# Altium project p5n5.PrjPcb
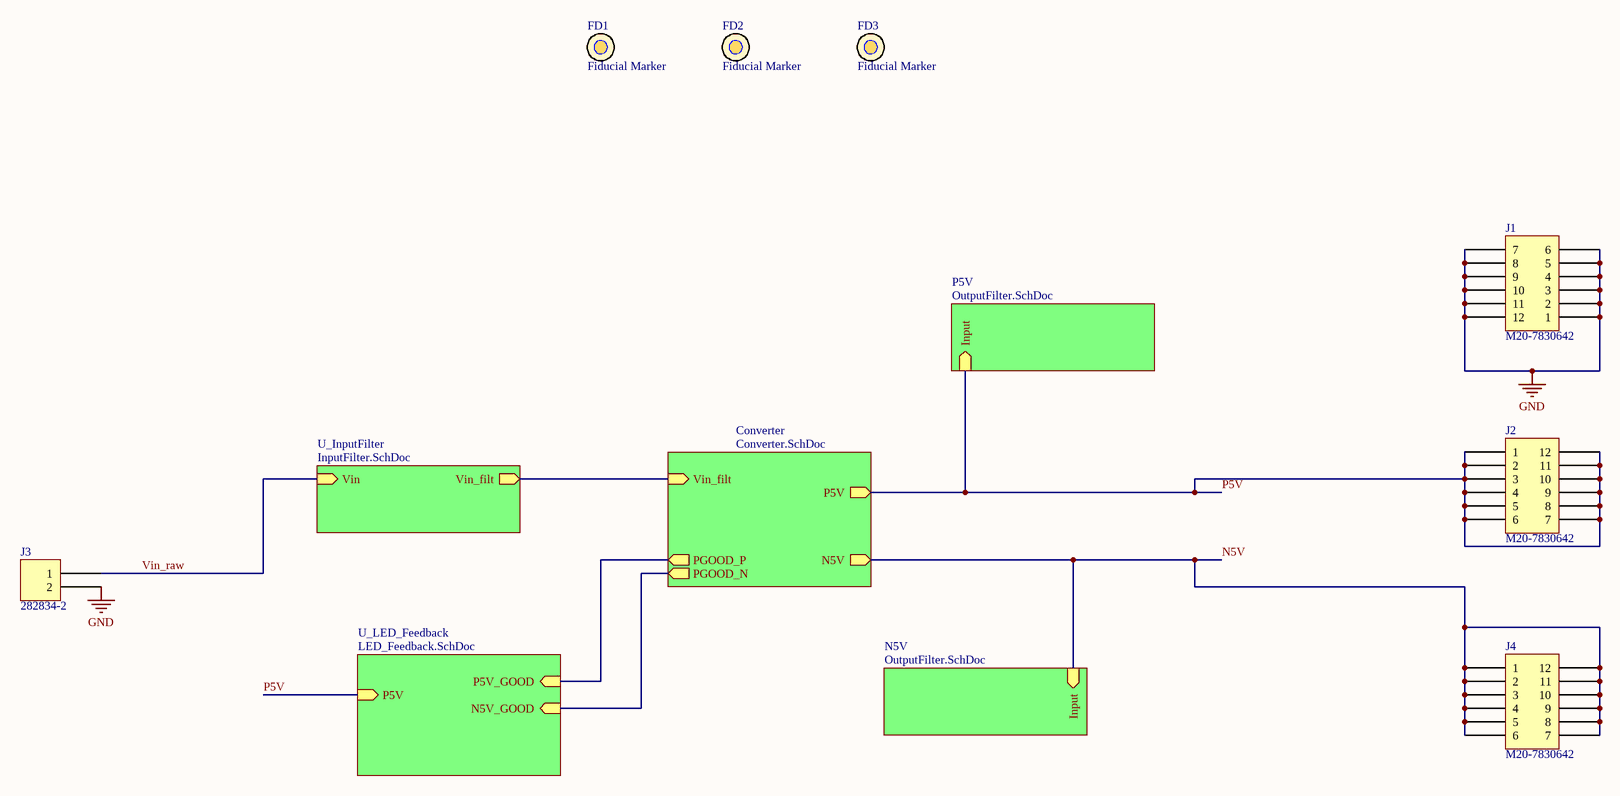
[diagram p0: TopLevel.SchDoc]
5 sheets, 50 parts. Net scope: hierarchical (ports join the sheet entries above them; power ports are global).
Board file: Board_Single.PcbDoc
Sheets:
  TopLevel.SchDoc
    Converter = Converter.SchDoc
    U_InputFilter = InputFilter.SchDoc
    P5V = OutputFilter.SchDoc
    N5V = OutputFilter.SchDoc
    U_LED_Feedback = LED_Feedback.SchDoc

## Sheet TopLevel.SchDoc
size B; SheetNumber: 1; SheetTotal: 5

### Parts
FD1  Fiducial Marker  [FIDUCIAL]
FD2  Fiducial Marker  [FIDUCIAL]
FD3  Fiducial Marker  [FIDUCIAL]
J1  M20-7830642  [HARWIN M20-7830645]
J2  M20-7830642  [HARWIN M20-7830645]
J3  282834-2  [TE 282834-2]
J4  M20-7830642  [HARWIN M20-7830645]

### Sub-sheets
Converter = Converter.SchDoc: PGOOD_P (out), N5V (out), Vin_filt (in), P5V (out), PGOOD_N (out)
N5V = OutputFilter.SchDoc: Input (in)
P5V = OutputFilter.SchDoc: Input (in)
U_InputFilter = InputFilter.SchDoc: Vin (in), Vin_filt (out)
U_LED_Feedback = LED_Feedback.SchDoc: P5V (in), P5V_GOOD (in), N5V_GOOD (in)

### Nets
GND: J1.1 J1.2 J1.3 J1.4 J1.5 J1.6 J1.7 J1.8 J1.9 J1.10 J1.11 J1.12 J3.2
N5V: J4.1 J4.2 J4.3 J4.4 J4.5 J4.6 J4.7 J4.8 J4.9 J4.10 J4.11 J4.12 ; sheet Converter/N5V, sheet N5V/Input
P5V: J2.1 J2.2 J2.3 J2.4 J2.5 J2.6 J2.7 J2.8 J2.9 J2.10 J2.11 J2.12 ; sheet Converter/P5V, sheet P5V/Input, sheet U_LED_Feedback/P5V
PGOOD_N: sheet Converter/PGOOD_N, sheet U_LED_Feedback/N5V_GOOD
PGOOD_P: sheet Converter/PGOOD_P, sheet U_LED_Feedback/P5V_GOOD
Vin_filt: sheet Converter/Vin_filt, sheet U_InputFilter/Vin_filt
Vin_raw: J3.1 ; sheet U_InputFilter/Vin

### Library data of the parts
FD1-FD3 = Fiducial
J1 J2 J4 = M20-7830642: CONN RCPT 12POS 0.1 GOLD PCB; Manufacturer: Harwin Inc.; Connector Type: Receptacle; Contact Length - Post: 0.118" (3.00mm); Current Rating (Amps): 3A; Mated Stacking Heights: 11.04mm, 12.63mm; Material Flammability Rating: UL94 V-0; Number of Positions: 12; Number of Positions Loaded: All; Pitch - Mating: 0.100" (2.54mm); Style: Board to Board or Cable; Part Number: M20-7830642; ComponentLink1Description: Datasheet; ComponentLink1URL: https://cdn.harwin.com/pdfs/C001XX_M20_Series_Connectors.pdf; ComponentLink2Description: DigiKey Link; ComponentLink2URL: https://www.digikey.com/en/products/detail/harwin-inc/M20-7830642/3727774; Contact Finish - Mating: Gold; Contact Finish - Post: Tin; Contact Finish Thickness - Mating: Flash; Contact Type: Female Socket; Fastening Type: Push-Pull; Insulation Color: Black; Insulation Height: 0.335" (8.51mm); LastUpdated: 9/21/2022 7:05:46 PM; Lifecycle Status: Active; Minimum Order: 1; Mounting Type: Through Hole; Number of Rows: 2; Operating Temperature: -40°C ~ 105°C; Packaging: Tube; Part Status: Active; Price: 0.96; Row Spacing - Mating: 0.100" (2.54mm); Series: M20; Supplier 1: DigiKey; Supplier Part Number 1: 952-1805-ND; Termination: Solder
J3 = 282834-2: TERM BLK 2P SIDE ENT 2.54MM PCB; Manufacturer: TE Connectivity AMP Connectors; Current: 10A; Mating Orientation: Horizontal with Board; Number of Levels: 1; Pitch: 0.100" (2.54mm); Positions Per Level: 2; Voltage: 150V; Wire Gauge: 16-30 AWG; Wire Termination: Screw - Rising Cage Clamp; Part Number: 282834-2; Color: Green; ComponentLink1Description: Datasheet; ComponentLink1URL: https://www.te.com/commerce/DocumentDelivery/DDEController?Action=srchrtrv&DocNm=282834&DocType=Customer+Drawing&DocLang=English; ComponentLink2Description: DigiKey Link; ComponentLink2URL: http://digikey.com/product-detail/en/te-connectivity-amp-connectors/282834-2/A98333-ND/1150135; LastUpdated: 1/15/2020 4:15:38 AM; Lifecycle Status: Active; Minimum Order: 1; Mounting Type: Through Hole; Packaging: Bulk; Part Status: Active; Price: 0.88; Series: Buchanan; Supplier 1: DigiKey; Supplier Part Number 1: A98333-ND

## Sheet Converter.SchDoc
size A; SheetNumber: 2; SheetTotal: 5
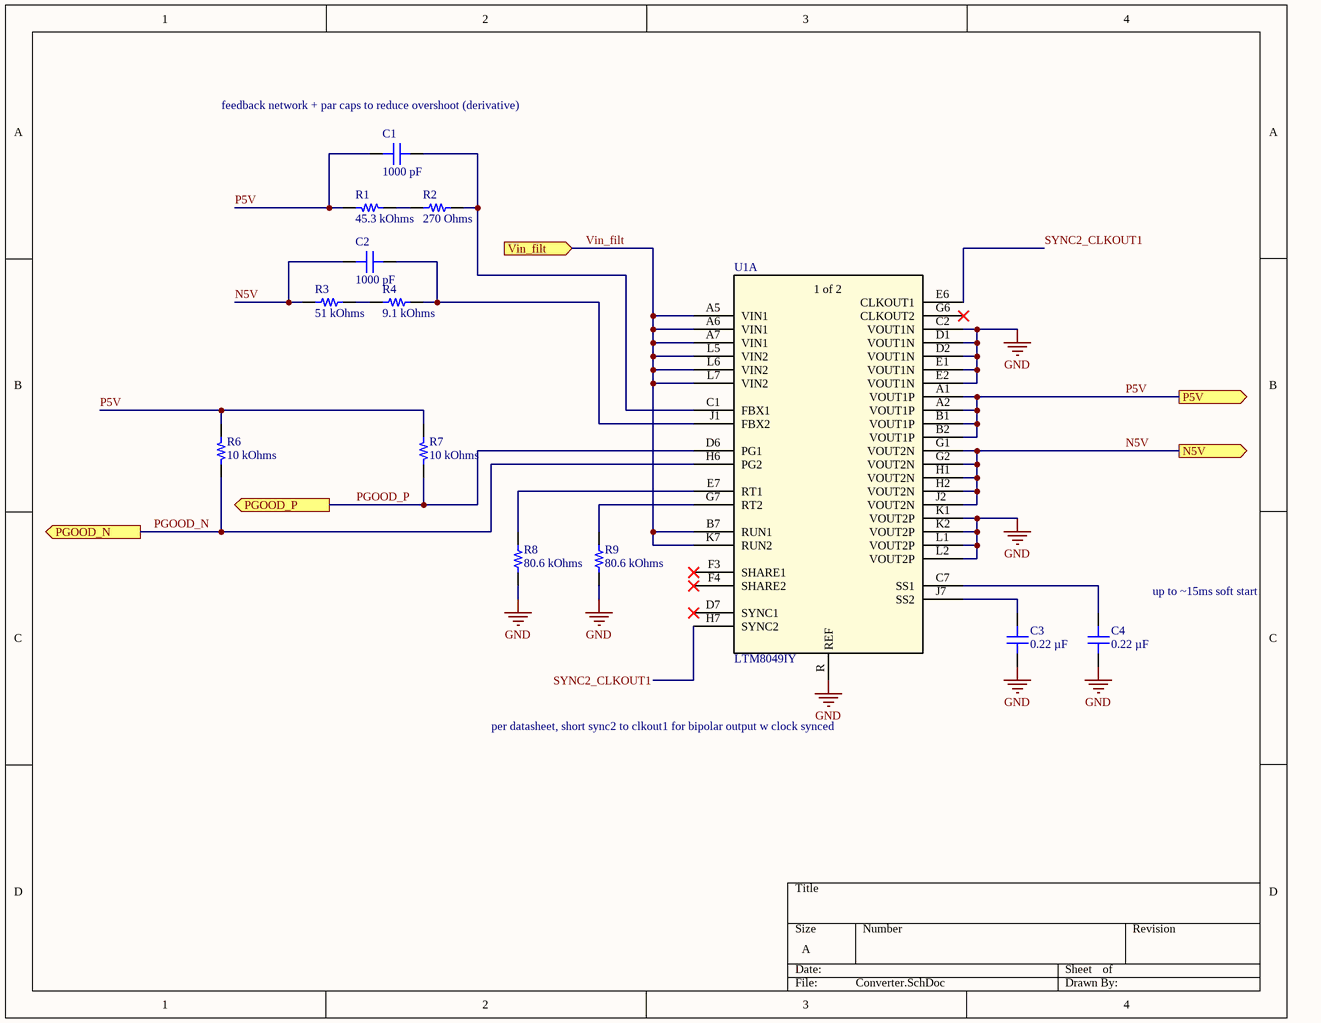
[diagram p1: Converter.SchDoc]

### Parts
C1  1000 pF  [CAP 0805_2012]
C2  1000 pF  [CAP 0805_2012]
C3  0.22 µF  [CAP 0805_2012]
C4  0.22 µF  [CAP 0805_2012]
R1  45.3 kOhms  [RES 1206_3216]
R2  270 Ohms  [RES 0805_2012]
R3  51 kOhms  [RES 0805_2012]
R4  9.1 kOhms  [RES 0805_2012]
R6  10 kOhms  [RES 0805_2012]
R7  10 kOhms  [RES 0805_2012]
R8  80.6 kOhms  [RES 1206_3216]
R9  80.6 kOhms  [RES 1206_3216]
U1  LTM8049IY  [LTM8049IY_ADI]  (part A of 2)

### Ports
N5V (out), P5V (out), PGOOD_N (out), PGOOD_P (out), Vin_filt (in)

### Nets
GND: C3.1 C4.1 R8.1 R9.1 U1.C2(VOUT1N) U1.D1(VOUT1N) U1.D2(VOUT1N) U1.E1(VOUT1N) U1.E2(VOUT1N) U1.K1(VOUT2P) U1.K2(VOUT2P) U1.L1(VOUT2P) U1.L2(VOUT2P) U1.R(REF)
N5V: C2.1 R3.1 U1.G1(VOUT2N) U1.G2(VOUT2N) U1.H1(VOUT2N) U1.H2(VOUT2N) U1.J2(VOUT2N) ; port N5V
P5V: C1.1 R1.1 R6.2 R7.2 U1.A1(VOUT1P) U1.A2(VOUT1P) U1.B1(VOUT1P) U1.B2(VOUT1P) ; port P5V
PGOOD_N: R6.1 U1.H6(PG2) ; port PGOOD_N
PGOOD_P: R7.1 U1.D6(PG1) ; port PGOOD_P
SYNC2_CLKOUT1: U1.E6(CLKOUT1) U1.H7(SYNC2)
Vin_filt: U1.A5(VIN1) U1.A6(VIN1) U1.A7(VIN1) U1.B7(RUN1) U1.K7(RUN2) U1.L5(VIN2) U1.L6(VIN2) U1.L7(VIN2) ; port Vin_filt
NetC1_2: C1.2 R2.2 U1.C1(FBX1)
NetC2_2: C2.2 R4.2 U1.J1(FBX2)
NetC3_2: C3.2 U1.J7(SS2)
NetC4_2: C4.2 U1.C7(SS1)
NetR1_2: R1.2 R2.1
NetR3_2: R3.2 R4.1
NetR8_2: R8.2 U1.E7(RT1)
NetR9_2: R9.2 U1.G7(RT2)

Not connected (* = marked no-connect by the designer): U1 D7(SYNC1)* F3(SHARE1)* F4(SHARE2)* G6(CLKOUT2)*

### Notes on the sheet
- (near C1) feedback network + par caps to reduce overshoot (derivative)
- up to ~15ms soft start
- per datasheet, short sync2 to clkout1 for bipolar output w clock synced
- (in symbol LTM8049IY, part A) 1 of 2

### Library data of the parts
C1 C2 = C0805C102J5RAC7800: CAP CER 1000PF 50V X7R 0805; Part Number: C0805C102J5RACTU; manufacturer: KEMET; Tolerance: ±5%; Value: 1000 pF; Applications: Bypass, Decoupling; Capacitance: 1000 pF; componentlink1description: Datasheet; componentlink1url: https://api.kemet.com/component-edge/download/datasheet/C0805C102J5RACTU.pdf; componentlink2description: DigiKey Link; componentlink2url: https://www.digikey.com/en/products/detail/kemet/C0805C102J5RAC7800/411148; Device Package: 0805 (2012 Metric); lastupdated: 7/15/2023 7:10:24 PM; Lifecycle Status: Active; Minimum Order: 1; Mounting Type: Surface Mount, MLCC; Operating Temperature: -55°C ~ 125°C; Package / Case: 0805 (2012 Metric); packaging: TapeAndReel; partid: 32561; Part Status: Active; price: 0.01; series: SMD Comm X7R; Size / Dimension: 0.079" L x 0.049" W (2.00mm x 1.25mm); Supplier 1: DigiKey; Supplier Part Number 1: 399-C0805C102J5RAC7800CT-ND; Temperature Coefficient: X7R; Thickness (Max): 0.035" (0.88mm); Voltage - Rated: 50V
C3 C4 = C0805C224K5RAC7800: CAP CER 0.22UF 50V X7R 0805; Part Number: C0805C224K5RACTU; manufacturer: KEMET; Tolerance: ±10%; Value: 0.22 µF; Applications: Bypass, Decoupling; Capacitance: 0.22 µF; componentlink1description: Datasheet; componentlink1url: https://api.kemet.com/component-edge/download/datasheet/C0805C224K5RACTU.pdf; componentlink2description: DigiKey Link; componentlink2url: https://www.digikey.com/en/products/detail/kemet/C0805C224K5RAC7800/754753; Device Package: 0805 (2012 Metric); lastupdated: 7/15/2023 7:10:33 PM; Lifecycle Status: Active; Minimum Order: 1; Mounting Type: Surface Mount, MLCC; Operating Temperature: -55°C ~ 125°C; Package / Case: 0805 (2012 Metric); packaging: TapeAndReel; partid: 33070; Part Status: Active; price: 0.02; series: SMD Comm X7R; Size / Dimension: 0.079" L x 0.049" W (2.00mm x 1.25mm); Supplier 1: DigiKey; Supplier Part Number 1: 399-C0805C224K5RACTUCT-ND; Temperature Coefficient: X7R; Thickness (Max): 0.055" (1.40mm); Voltage - Rated: 50V
R1 = ERA-8ARW4532V: RES SMD 45.3KOHM 0.05% 1/4W 1206; Manufacturer: Panasonic Electronic Components; Power (Watts): 0.25W, 1/4W; Temperature Coefficient: ±10ppm/°C; Part Number: ERA-8ARW4532V; ComponentLink1Description: Datasheet; ComponentLink1URL: https://industrial.panasonic.com/cdbs/www-data/pdf/RDM0000/AOA0000C307.pdf; ComponentLink2Description: DigiKey Link; ComponentLink2URL: https://www.digikey.com/en/products/detail/panasonic-electronic-components/ERA-8ARW4532V/5163072; Composition: Thin Film; Device Package: 1206 (3216 Metric); Features: Automotive AEC-Q200; Height - Seated (Max): 0.028" (0.70mm); LastUpdated: 7/13/2023 7:33:23 PM; Lifecycle Status: Active; Minimum Order: 1; Number of Terminations: 2; Operating Temperature: -55°C ~ 155°C; Package / Case: 1206 (3216 Metric); Packaging: TapeAndReel; PartId: 46049; Part Status: Active; Price: 0.56; Ratings: AEC-Q200; Resistance: 45.3 kOhms; Series: ERA-8A; Size / Dimension: 0.126" L x 0.063" W (3.20mm x 1.60mm); Supplier 1: DigiKey; Supplier Part Number 1: P18856CT-ND; Supplier Device Package: 1206; Tolerance: ±0.05%; Value: 45.3 kOhms
R2 = ERJ-PB6B2700V: RES SMD 270 OHM 0.1% 1/4W 0805; Manufacturer: Panasonic Electronic Components; Power (Watts): 0.25W, 1/4W; Temperature Coefficient: ±50ppm/°C; Part Number: ERJ-PB6B2700V; Value: 270 Ohms; ComponentLink1Description: Datasheet; ComponentLink1URL: https://industrial.panasonic.com/cdbs/www-data/pdf/RDM0000/AOA0000C328.pdf; ComponentLink2Description: DigiKey Link; ComponentLink2URL: https://www.digikey.com/en/products/detail/panasonic-electronic-components/ERJ-PB6B2700V/6213310; Composition: Thick Film; Device Package: 0805 (2012 Metric); Features: Automotive AEC-Q200, Pulse Withstanding; Height - Seated (Max): 0.028" (0.70mm); LastUpdated: 8/6/2023 8:08:39 PM; Lifecycle Status: Active; Minimum Order: 1; Number of Terminations: 2; Operating Temperature: -55°C ~ 155°C; Package / Case: 0805 (2012 Metric); Packaging: TapeAndReel; PartId: 31052; Part Status: Active; Price: 0.04; Ratings: AEC-Q200; Resistance: 270 Ohms; Series: ERJ-PB6; Size / Dimension: 0.079" L x 0.049" W (2.00mm x 1.25mm); Supplier 1: DigiKey; Supplier Part Number 1: P20527CT-ND; Supplier Device Package: 0805; Tolerance: ±0.1%
R3 = TNPW080551K0BEEA: RES 51K OHM 0.1% 1/8W 0805; Manufacturer: Vishay Dale; Power (Watts): 0.125W, 1/8W; Temperature Coefficient: ±25ppm/°C; Part Number: TNPW080551K0BEEA; Value: 51 kOhms; ComponentLink1Description: Datasheet; ComponentLink1URL: http://www.vishay.com/docs/28758/tnpw_e3.pdf; ComponentLink2Description: DigiKey Link; ComponentLink2URL: https://www.digikey.com/en/products/detail/vishay-dale/TNPW080551K0BEEA/1607476; Composition: Thin Film; Device Package: 0805 (2012 Metric); Features: Anti-Sulfur, Automotive AEC-Q200, Moisture Resistant; Height - Seated (Max): 0.022" (0.55mm); LastUpdated: 8/6/2023 8:07:38 PM; Lifecycle Status: Active; Minimum Order: 1; Number of Terminations: 2; Operating Temperature: -55°C ~ 155°C; Package / Case: 0805 (2012 Metric); Packaging: TapeAndReel; PartId: 45487; Part Status: Active; Price: 0.16; Ratings: AEC-Q200; Resistance: 51 kOhms; Series: TNPW e3; Size / Dimension: 0.079" L x 0.049" W (2.00mm x 1.25mm); Supplier 1: DigiKey; Supplier Part Number 1: 541-3220-1-ND; Supplier Device Package: 0805; Tolerance: ±0.1%
R4 = TNPW08059K10BEEA: RES 9.1K OHM 0.1% 1/8W 0805; Manufacturer: Vishay Dale; Power (Watts): 0.2W, 1/5W; Temperature Coefficient: ±25ppm/°C; Part Number: TNPW08059K10BEEA; Value: 9.1 kOhms; ComponentLink1Description: Datasheet; ComponentLink1URL: http://www.vishay.com/docs/28758/tnpw_e3.pdf; ComponentLink2Description: DigiKey Link; ComponentLink2URL: http://digikey.com/product-detail/en/vishay-dale/TNPW08059K10BEEA/541-9869-1-ND/9659137; Composition: Thin Film; Device Package: 0805 (2012 Metric); Features: Anti-Sulfur, Automotive AEC-Q200, Moisture Resistant; Height - Seated (Max): 0.022" (0.55mm); LastUpdated: 8/6/2023 8:07:38 PM; Lifecycle Status: Active; Minimum Order: 1; Number of Terminations: 2; Operating Temperature: -55°C ~ 155°C; Package / Case: 0805 (2012 Metric); Packaging: TapeAndReel; PartId: 45465; Part Status: Active; Price: 0.18; Ratings: AEC-Q200; Resistance: 9.1 kOhms; Series: TNPW e3; Size / Dimension: 0.079" L x 0.049" W (2.00mm x 1.25mm); Supplier 1: DigiKey; Supplier Part Number 1: 541-9869-1-ND; Supplier Device Package: 0805; Tolerance: ±0.1%
R6 R7 = RT0805FRE1310KL: RES 10K OHM 1% 1/8W 0805; Manufacturer: Yageo; Power (Watts): 0.125W, 1/8W; Temperature Coefficient: ±50ppm/°C; Part Number: RT0805FRE1310KL; Value: 10 kOhms; ComponentLink1Description: Datasheet; ComponentLink1URL: https://www.yageo.com/upload/media/product/productsearch/datasheet/rchip/PYu-RT_1-to-0.01_RoHS_L_13.pdf; ComponentLink2Description: DigiKey Link; ComponentLink2URL: https://www.digikey.com/en/products/detail/yageo/RT0805FRE1310KL/16982152; Composition: Thin Film; Device Package: 0805 (2012 Metric); Features: Moisture Resistant; Height - Seated (Max): 0.024" (0.60mm); LastUpdated: 7/12/2023 7:50:22 PM; Lifecycle Status: Active; Minimum Order: 1; Number of Terminations: 2; Operating Temperature: -55°C ~ 155°C; Package / Case: 0805 (2012 Metric); Packaging: TapeAndReel; PartId: 76856; Part Status: Active; Price: 0.01; Resistance: 10 kOhms; Series: RT; Size / Dimension: 0.079" L x 0.049" W (2.00mm x 1.25mm); Supplier 1: DigiKey; Supplier Part Number 1: 13-RT0805FRE1310KLCT-ND; Supplier Device Package: 0805; Tolerance: ±1%
R8 R9 = ERA-8AEB8062V: RES SMD 80.6K OHM 0.1% 1/4W 1206; Manufacturer: Panasonic Electronic Components; Power (Watts): 0.25W, 1/4W; Temperature Coefficient: ±25ppm/°C; Part Number: ERA-8AEB8062V; ComponentLink1Description: Datasheet; ComponentLink1URL: https://industrial.panasonic.com/cdbs/www-data/pdf/RDM0000/AOA0000C307.pdf; ComponentLink2Description: DigiKey Link; ComponentLink2URL: https://www.digikey.com/en/products/detail/panasonic-electronic-components/ERA-8AEB8062V/3071179; Composition: Thin Film; Device Package: 1206 (3216 Metric); Features: Automotive AEC-Q200; Height - Seated (Max): 0.028" (0.70mm); LastUpdated: 8/5/2023 7:52:37 PM; Lifecycle Status: Active; Minimum Order: 1; Number of Terminations: 2; Operating Temperature: -55°C ~ 155°C; Package / Case: 1206 (3216 Metric); Packaging: TapeAndReel; PartId: 42629; Part Status: Active; Price: 0.10; Ratings: AEC-Q200; Resistance: 80.6 kOhms; Series: ERA-8A; Size / Dimension: 0.126" L x 0.063" W (3.20mm x 1.60mm); Supplier 1: DigiKey; Supplier Part Number 1: P80.6KBCCT-ND; Supplier Device Package: 1206; Tolerance: ±0.1%; Value: 80.6 kOhms
U1 = LTM8049IY: No Description Available; Manufacturer: Analog Devices Inc; RefDes: RefDes; Type: Type; Part Number: LTM8049IY

## Sheet InputFilter.SchDoc
size A; SheetNumber: 4; SheetTotal: 5
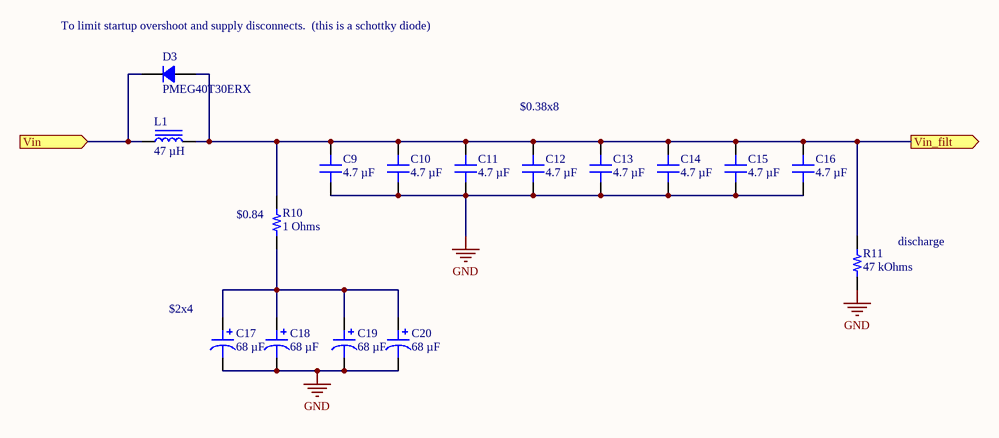
[diagram p2: InputFilter.SchDoc]

### Parts
C9  4.7 µF  [CAP 1206_3216 - 0.8MM]
C10  4.7 µF  [CAP 1206_3216 - 0.8MM]
C11  4.7 µF  [CAP 1206_3216 - 0.8MM]
C12  4.7 µF  [CAP 1206_3216 - 0.8MM]
C13  4.7 µF  [CAP 1206_3216 - 0.8MM]
C14  4.7 µF  [CAP 1206_3216 - 0.8MM]
C15  4.7 µF  [CAP 1206_3216 - 0.8MM]
C16  4.7 µF  [CAP 1206_3216 - 0.8MM]
C17  68 µF  [CAP POL 2917_7343]
C18  68 µF  [CAP POL 2917_7343]
C19  68 µF  [CAP POL 2917_7343]
C20  68 µF  [CAP POL 2917_7343]
D3  PMEG40T30ERX  [SOD-123W]
L1  47 µH  [WURTH WE-HCF 14.5MM]
R10  1 Ohms  [RES 2512_6432]
R11  47 kOhms  [RES 1206_3216]

### Ports
Vin (in), Vin_filt (out)

### Nets
GND: C9.1 C10.1 C11.1 C12.1 C13.1 C14.1 C15.1 C16.1 C17.2 C18.2 C19.2 C20.2 R11.1
Vin_filt: C9.2 C10.2 C11.2 C12.2 C13.2 C14.2 C15.2 C16.2 D3.1 L1.1 R10.2 R11.2 ; port Vin_filt
Vin_raw: D3.2 L1.2 ; port Vin
NetC17_1: C17.1 C18.1 C19.1 C20.1 R10.1

### Notes on the sheet
- (near D3) To limit startup overshoot and supply disconnects.  (this is a schottky diode)
- $0.38x8
- (near R10) $0.84
- (near R11) discharge
- (near C17) $2x4

### Library data of the parts
C9-C16 = C1206C475K5RAC7800: CAP CER 4.7UF 50V X7R 1206; Part Number: C1206C475K5RACTU; manufacturer: KEMET; Tolerance: ±10%; Value: 4.7 µF; Applications: Bypass, Decoupling; Capacitance: 4.7 µF; componentlink1description: Datasheet; componentlink1url: https://api.kemet.com/component-edge/download/datasheet/C1206C475K5RACTU.pdf; componentlink2description: DigiKey Link; componentlink2url: https://www.digikey.com/en/products/detail/kemet/C1206C475K5RAC7800/5119822; Device Package: 1206 (3216 Metric); lastupdated: 7/15/2023 7:14:03 PM; Lifecycle Status: Active; Minimum Order: 1; Mounting Type: Surface Mount, MLCC; Operating Temperature: -55°C ~ 125°C; Package / Case: 1206 (3216 Metric); packaging: TapeAndReel; partid: 38858; Part Status: Active; price: 0.07; series: SMD Comm X7R; Size / Dimension: 0.126" L x 0.063" W (3.20mm x 1.60mm); Supplier 1: DigiKey; Supplier Part Number 1: 399-C1206C475K5RAC7800CT-ND; Temperature Coefficient: X7R; Thickness (Max): 0.071" (1.80mm); Voltage - Rated: 50V
C17-C20 = T491X686K025AT: CAP TANT 68UF 10% 25V 2917; manufacturer: KEMET; Manufacturer Size Code: X; ESR (Equivalent Series Resistance): 700mOhm; Lifetime @ Temp.: 2000 Hrs @ 125°C; Type: Molded; Part Number: T491X686K025AT; Value: 68 µF; Capacitance: 68 µF; componentlink1description: Datasheet; componentlink1url: https://api.kemet.com/component-edge/download/datasheet/T491X686K025AT.pdf; componentlink2description: DigiKey Link; componentlink2url: https://www.digikey.com/en/products/detail/kemet/T491X686K025AT/2336396; Device Package: 2917 (7343 Metric); Features: General Purpose; Height - Seated (Max): 0.169" (4.30mm); lastupdated: 7/13/2023 7:40:28 PM; Lifecycle Status: Active; Minimum Order: 1; Mounting Type: Surface Mount; Operating Temperature: -55°C ~ 125°C; Package / Case: 2917 (7343 Metric); packaging: TapeAndReel; partid: 3138; Part Status: Active; price: 0.74; series: T491; Size / Dimension: 0.287" L x 0.169" W (7.30mm x 4.30mm); Supplier 1: DigiKey; Supplier Part Number 1: 399-8424-1-ND; Tolerance: ±10%; Voltage - Rated: 25 V
D3 = PMEG40T30ERX: DIODE SCHOTTKY 40V 3A SOD123W; Manufacturer: Nexperia USA Inc.; Capacitance @ Vr, F: 560pF @ 1V, 1MHz; Current - Reverse Leakage @ Vr: 28 µA @ 40 V; Reverse Recovery Time (trr): 18 ns; Speed: Fast Recovery =< 500ns, > 200mA (Io); Voltage - Forward (Vf) (Max) @ If: 460 mV @ 3 A; Part Number: PMEG40T30ERX; ComponentLink1Description: Datasheet; ComponentLink1URL: https://assets.nexperia.com/documents/data-sheet/PMEG40T30ER.pdf; ComponentLink2Description: DigiKey Link; ComponentLink2URL: https://www.digikey.com/en/products/detail/nexperia-usa-inc/PMEG40T30ERX/7794686; Current - Average Rectified (Io): 3A; Diode Type: Schottky; LastUpdated: 8/5/2023 9:09:43 PM; Lifecycle Status: Active; Minimum Order: 1; Mounting Type: Surface Mount; Operating Temperature - Junction: 175°C (Max); Package / Case: SOD-123W; Packaging: TapeAndReel; PartId: 3171; Part Status: Active; Price: 0.10; Series: Automotive, AEC-Q101; Supplier 1: DigiKey; Supplier Part Number 1: 1727-7481-1-ND; Supplier Device Package: SOD-123W; Voltage - DC Reverse (Vr) (Max): 40 V
L1 = 7443634700: FIXED IND 47UH 12A 12.2 MOHM SMD; Manufacturer: Würth Elektronik; Current - Saturation: 8.5A; Frequency - Self Resonant: 10MHz; Inductance Frequency - Test: 100 kHz; Material - Core: Manganese Zinc Ferrite (MnZn); Shielding: Shielded; Tolerance: ±15%; Type: Drum Core, Wirewound; Part Number: 7443634700; ComponentLink1Description: Datasheet; ComponentLink1URL: https://katalog.we-online.de/pbs/datasheet/7443634700.pdf; ComponentLink2Description: DigiKey Link; ComponentLink2URL: https://www.digikey.com/en/products/detail/würth-elektronik/7443634700/2440342; Current Rating (Amps): 12 A; DC Resistance (DCR): 12.2mOhm; Device Package: Nonstandard; Height - Seated (Max): 0.571" (14.50mm); Inductance: 47 µH; LastUpdated: 7/12/2023 8:30:57 PM; Lifecycle Status: Active; Minimum Order: 1; Mounting Type: Surface Mount; Operating Temperature: -40°C ~ 125°C; Package / Case: Nonstandard; Packaging: TapeAndReel; PartId: 3230; Part Status: Active; Price: 4.84; Ratings: AEC-Q200; Series: WE-HCF; Size / Dimension: 0.858" L x 0.846" W (21.80mm x 21.50mm); Supplier 1: DigiKey; Supplier Part Number 1: 732-2525-1-ND; Value: 47 µH
R10 = RHC2512FT1R00: RES 1 OHM 1% 2W 2512; Manufacturer: Stackpole Electronics Inc; Temperature Coefficient: ±100ppm/°C; Part Number: RHC2512FT1R00; ComponentLink1Description: Datasheet; ComponentLink1URL: https://www.seielect.com/catalog/sei-rhc.pdf; ComponentLink2Description: DigiKey Link; ComponentLink2URL: https://www.digikey.com/en/products/detail/stackpole-electronics-inc/RHC2512FT1R00/1646034; Composition: Thick Film; Device Package: 2512 (6432 Metric); Features: Moisture Resistant; Height - Seated (Max): 0.028" (0.70mm); LastUpdated: 2/17/2022 6:29:24 PM; Lifecycle Status: Active; Minimum Order: 1; Number of Terminations: 2; Operating Temperature: -55°C ~ 155°C; Package / Case: 2512 (6432 Metric); Packaging: TapeAndReel; Part Status: Active; Power (Watts): 2W; Price: 0.35; Resistance: 1 Ohms; Series: RHC; Size / Dimension: 0.248" L x 0.126" W (6.30mm x 3.20mm); Supplier 1: DigiKey; Supplier Part Number 1: RHC2512FT1R00CT-ND; Supplier Device Package: 2512; Tolerance: ±1%; Value: 1 Ohms
R11 = CRCW120647K0FKEA: RES SMD 47K OHM 1% 1/4W 1206; Manufacturer: Vishay Dale; Power (Watts): 0.25W, 1/4W; Temperature Coefficient: ±100ppm/°C; Part Number: CRCW120647K0FKEA; ComponentLink1Description: Datasheet; ComponentLink1URL: http://www.vishay.com/docs/20035/dcrcwe3.pdf; ComponentLink2Description: DigiKey Link; ComponentLink2URL: https://www.digikey.com/en/products/detail/vishay-dale/CRCW120647K0FKEA/1176834; Composition: Thick Film; Device Package: 1206 (3216 Metric); Features: Automotive AEC-Q200; Height - Seated (Max): 0.024" (0.60mm); LastUpdated: 8/5/2023 7:53:13 PM; Lifecycle Status: Active; Minimum Order: 1; Number of Terminations: 2; Operating Temperature: -55°C ~ 155°C; Package / Case: 1206 (3216 Metric); Packaging: TapeAndReel; PartId: 33069; Part Status: Active; Price: 0.01; Ratings: AEC-Q200; Resistance: 47 kOhms; Series: CRCW; Size / Dimension: 0.126" L x 0.063" W (3.20mm x 1.60mm); Supplier 1: DigiKey; Supplier Part Number 1: 541-47.0KFCT-ND; Supplier Device Package: 1206; Tolerance: ±1%; Value: 47 kOhms

## Sheet OutputFilter.SchDoc
size A; SheetNumber: 3; SheetTotal: 5
Used 2 times, as channels P5V, N5V. Parts and nets are listed once, with the designators drawn on the sheet.
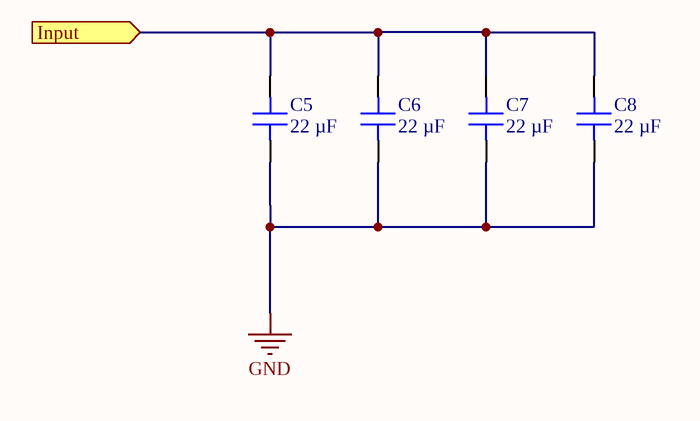
[diagram p3: OutputFilter.SchDoc]

### Parts
C5  22 µF  [CAP 1812_4532 1.1MM]
C6  22 µF  [CAP 1812_4532 1.1MM]
C7  22 µF  [CAP 1812_4532 1.1MM]
C8  22 µF  [CAP 1812_4532 1.1MM]

### Ports
Input (in)

### Nets
GND: C5.1 C6.1 C7.1 C8.1
Input: C5.2 C6.2 C7.2 C8.2 ; port Input

### Channels
P5V: designators end in _P5V; ports Input=P5V
N5V: designators end in _N5V; ports Input=N5V

### Library data of the parts
C5-C8 = CGA8P1X7R1E226M250KC: CAP CER 22UF 25V X7R 1812; manufacturer: TDK Corporation; Tolerance: ±20%; Part Number: CGA8P1X7R1E226M250KC; Value: 22 µF; Applications: Automotive; Capacitance: 22 µF; componentlink1description: Datasheet; componentlink1url: https://product.tdk.com/info/en/catalog/datasheets/mlcc_automotive_general_en.pdf?ref_disty=digikey; componentlink2description: DigiKey Link; componentlink2url: https://www.digikey.com/en/products/detail/tdk-corporation/CGA8P1X7R1E226M250KC/2781336; Device Package: 1812 (4532 Metric); lastupdated: 7/15/2023 7:18:32 PM; Lifecycle Status: Active; Minimum Order: 1; Mounting Type: Surface Mount, MLCC; Operating Temperature: -55°C ~ 125°C; Package / Case: 1812 (4532 Metric); packaging: TapeAndReel; Part Status: Active; price: 0.42; Ratings: AEC-Q200; series: CGA; Size / Dimension: 0.177" L x 0.126" W (4.50mm x 3.20mm); Supplier 1: DigiKey; Supplier Part Number 1: 445-7910-1-ND; Temperature Coefficient: X7R; Thickness (Max): 0.110" (2.80mm); Voltage - Rated: 25V

## Sheet LED_Feedback.SchDoc
size A; SheetNumber: 5; SheetTotal: 5
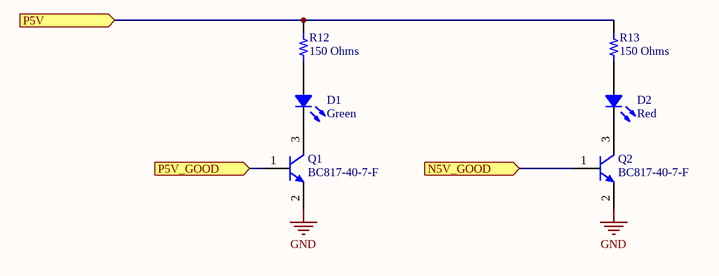
[diagram p4: LED_Feedback.SchDoc]

### Parts
D1  Green  [LED 0805_2012 GREEN]
D2  Red  [LED 0805_2012 RED]
Q1  BC817-40-7-F  [DIODES SOT-23-3]
Q2  BC817-40-7-F  [DIODES SOT-23-3]
R12  150 Ohms  [RES 1206_3216]
R13  150 Ohms  [RES 1206_3216]

### Ports
N5V_GOOD (in), P5V (in), P5V_GOOD (in)

### Nets
GND: Q1.2(E) Q2.2(E)
P5V: R12.2 R13.2 ; port P5V
PGOOD_N: Q2.1(B) ; port N5V_GOOD
PGOOD_P: Q1.1(B) ; port P5V_GOOD
NetD1_1: D1.1 R12.1
NetD1_2: D1.2 Q1.3(C)
NetD2_1: D2.1 R13.1
NetD2_2: D2.2 Q2.3(C)

### Library data of the parts
D1 = CMD17-21VGD/TR8: LED GREEN DIFFUSED 0805 SMD; Manufacturer: Visual Communications Company - VCC; Configuration: Standard; Current - Test: 20mA; Lens Size: 1.40mm x 1.25mm; Lens Style: Rectangle with Flat Top; Millicandela Rating: 7mcd; Viewing Angle: 140°; Voltage - Forward (Vf) (Typ): 2.1V; Wavelength - Peak: 570nm; Part Number: CMD17-21VGD/TR8; Color: Green; ComponentLink1Description: Datasheet; ComponentLink1URL: https://vcclite.com/wp-content/uploads/wpallimport/files/files/CMD1721Seriesver3.pdf; ComponentLink2Description: DigiKey Link; ComponentLink2URL: https://www.digikey.com/en/products/detail/visual-communications-company-vcc/CMD17-21VGD-TR8/254855; Device Package: 0805 (2012 Metric); Height (Max): 1.20mm; LastUpdated: 7/12/2023 8:17:31 PM; Lens Color: Green; Lens Transparency: Diffused; Lifecycle Status: Active; Minimum Order: 1; Mounting Type: Surface Mount; Package / Case: 0805 (2012 Metric); Packaging: TapeAndReel; PartId: 299; Part Status: Active; Price: 0.19; Series: CMD17-21; Size / Dimension: 2.00mm L x 1.25mm W; Supplier 1: DigiKey; Supplier Part Number 1: L62505CT-ND; Supplier Device Package: 0805; Value: Green
D2 = CMD17-21VRD/TR8: LED RED DIFFUSED 0805 SMD; Manufacturer: Visual Communications Company - VCC; Configuration: Standard; Current - Test: 20mA; Lens Size: 1.40mm x 1.25mm; Lens Style: Rectangle with Flat Top; Millicandela Rating: 6mcd; Viewing Angle: 140°; Voltage - Forward (Vf) (Typ): 2V; Wavelength - Peak: 640nm; Part Number: CMD17-21VRD/TR8; Color: Red; ComponentLink1Description: Datasheet; ComponentLink1URL: https://vcclite.com/wp-content/uploads/wpallimport/files/files/CMD1721Seriesver3.pdf; ComponentLink2Description: DigiKey Link; ComponentLink2URL: https://www.digikey.com/en/products/detail/visual-communications-company-vcc/CMD17-21VRD-TR8/254853; Device Package: 0805 (2012 Metric); Height (Max): 1.20mm; LastUpdated: 7/12/2023 8:17:11 PM; Lens Color: Red; Lens Transparency: Diffused; Lifecycle Status: Active; Minimum Order: 1; Mounting Type: Surface Mount; Package / Case: 0805 (2012 Metric); Packaging: TapeAndReel; PartId: 366; Part Status: Active; Price: 0.21; Series: CMD17-21; Size / Dimension: 2.00mm L x 1.25mm W; Supplier 1: DigiKey; Supplier Part Number 1: L62501CT-ND; Supplier Device Package: 0805; Value: Red
Q1 Q2 = BC817-40-7-F: TRANS NPN 45V 0.5A SOT23-3; Manufacturer: Diodes Incorporated; Current - Collector Cutoff (Max): 100nA; Current - Collector (Ic) (Max): 500 mA; DC Current Gain (hFE) (Min) @ Ic, Vce: 250 @ 100mA, 1V; Frequency - Transition: 100MHz; Power - Max: 310 mW; Vce Saturation (Max) @ Ib, Ic: 700mV @ 50mA, 500mA; Part Number: BC817-40-7-F; ComponentLink1Description: Datasheet; ComponentLink1URL: https://www.diodes.com/assets/Datasheets/ds11107.pdf; ComponentLink2Description: DigiKey Link; ComponentLink2URL: https://www.digikey.com/en/products/detail/diodes-incorporated/BC817-40-7-F/814998; LastUpdated: 8/6/2023 9:15:11 PM; Lifecycle Status: Active; Minimum Order: 1; Mounting Type: Surface Mount; Operating Temperature: -65°C ~ 150°C (TJ); Package / Case: TO-236-3, SC-59, SOT-23-3; Packaging: TapeAndReel; PartId: 116; Part Status: Active; Price: 0.02; Series: Automotive, AEC-Q101; Supplier 1: DigiKey; Supplier Part Number 1: BC817-40FDICT-ND; Supplier Device Package: SOT-23-3; Transistor Type: NPN; Voltage - Collector Emitter Breakdown (Max): 45 V
R12 R13 = RT1206FRE07150RL: RES SMD 150 OHM 1% 1/4W 1206; Manufacturer: Yageo; Power (Watts): 0.25W, 1/4W; Temperature Coefficient: ±50ppm/°C; Part Number: RT1206FRE07150RL; ComponentLink1Description: Datasheet; ComponentLink1URL: https://www.yageo.com/upload/media/product/productsearch/datasheet/rchip/PYu-RT_1-to-0.01_RoHS_L_12.pdf; ComponentLink2Description: DigiKey Link; ComponentLink2URL: https://www.digikey.com/en/products/detail/yageo/RT1206FRE07150RL/1082930; Composition: Thin Film; Device Package: 1206 (3216 Metric); Height - Seated (Max): 0.026" (0.65mm); LastUpdated: 7/12/2023 7:42:26 PM; Lifecycle Status: Active; Minimum Order: 1; Number of Terminations: 2; Operating Temperature: -55°C ~ 155°C; Package / Case: 1206 (3216 Metric); Packaging: TapeAndReel; PartId: 66998; Part Status: Active; Price: 0.01; Resistance: 150 Ohms; Series: RT; Size / Dimension: 0.122" L x 0.063" W (3.10mm x 1.60mm); Supplier 1: DigiKey; Supplier Part Number 1: 13-RT1206FRE07150RLCT-ND; Supplier Device Package: 1206; Tolerance: ±1%; Value: 150 Ohms

## Nets that join several sheets
GND: TopLevel (13 pins), Converter (14 pins), InputFilter (13 pins), P5V (C5_P5V.1 C6_P5V.1 C7_P5V.1 C8_P5V.1), N5V (C5_N5V.1 C6_N5V.1 C7_N5V.1 C8_N5V.1), LED_Feedback (Q1.2 Q2.2)
N5V: TopLevel (12 pins), Converter (7 pins), N5V (C5_N5V.2 C6_N5V.2 C7_N5V.2 C8_N5V.2)
P5V: TopLevel (12 pins), Converter (8 pins), P5V (C5_P5V.2 C6_P5V.2 C7_P5V.2 C8_P5V.2), LED_Feedback (R12.2 R13.2)
PGOOD_N: Converter (R6.1 U1.H6), LED_Feedback (Q2.1)
PGOOD_P: Converter (R7.1 U1.D6), LED_Feedback (Q1.1)
Vin_filt: Converter (8 pins), InputFilter (12 pins)
Vin_raw: TopLevel (J3.1), InputFilter (D3.2 L1.2)